# EAGLE design BoostConverter (EAGLE 9.3.1)
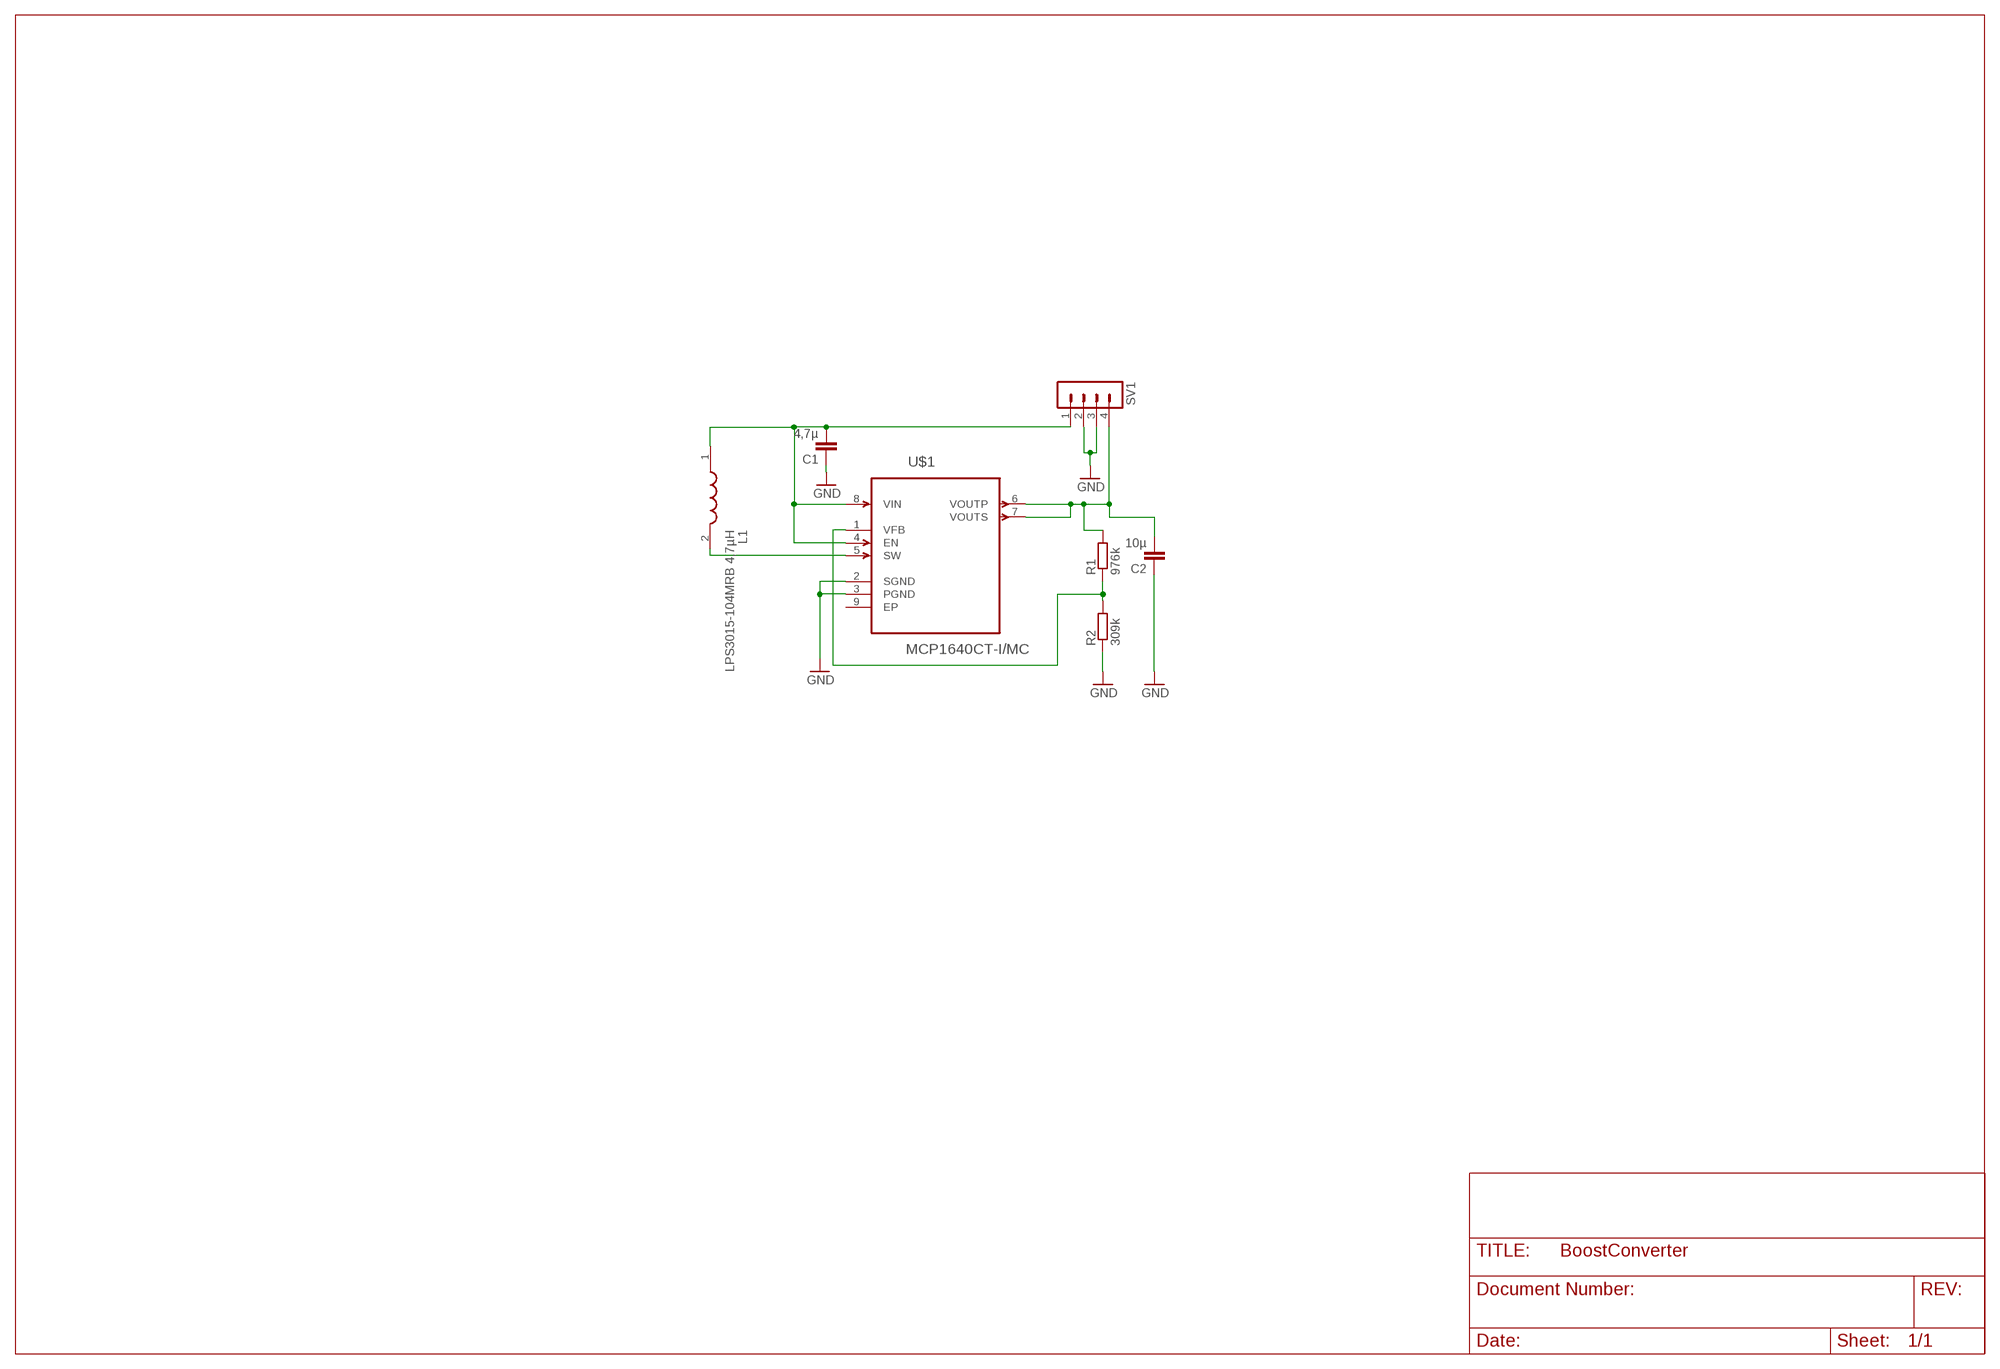
[diagram p0: schematic, sheet 1]

## Parts
C1  4,7µ  C-EUC0603  [C0603]
C2  10µ  C-EUC0603  [C0603]
L1  LPS3015-104MRB 4,7µH  LPS3015-104MRB  [LPS3015]
R1  976k  R-EU_R0603  [R0603]
R2  309k  R-EU_R0603  [R0603]
SV1  MA04-1  [MA04-1]
U$1  MCP1640CT-I/MC  [DFN200X300X100-9N]

## Nets
GND: C1.1 C2.1 R2.1 SV1.2 SV1.3 U$1.2(SGND) U$1.3(PGND)
N$1: C1.2 L1.1 SV1.1 U$1.4(EN) U$1.8(VIN)
N$4: L1.2 U$1.5(SW)
N$5: C2.2 R1.2 SV1.4 U$1.6(VOUTP) U$1.7(VOUTS)
N$6: R1.1 R2.2 U$1.1(VFB)
Unconnected: U$1.9(EP)

## Library data of the parts
C1 C2 = rcl:C-EU: CAPACITOR, European symbol; SPICEPREFIX: C
L1 = LPS3015-104MRB:LPS3015-104MRB: COILCRAFT - LPS3015-104MRB - INDUCTOR, SHLD, 100UH, 20%, 0.19A, SMD Source: Datasheet <http://www.coilcraft.com/pdfs/lps3015.pdf>; AVAILABILITY: Unavailable; DESCRIPTION: Power inductor, shielded, 20% tol, SMT, RoHS, lead-free, halogen-free; MF: Coilcraft; MP: LPS3015-104MRB; PACKAGE: None; PRICE: None
R1 R2 = rcl:R-EU_: RESISTOR, European symbol; SPICEPREFIX: R
SV1 = con-lstb:MA04-1: PIN HEADER; OC_FARNELL: unknown; OC_NEWARK: unknown
U$1 = MCP1640CT-I_MC:MCP1640CT-I/MC: Synchronous Boost Regulator; AVAILABILITY: Unavailable; DESCRIPTION: Boost Switching Regulator IC Positive Adjustable 2V 1 Output 350mA 8-VFDFN Exposed Pad; MF: Microchip; MP: MCP1640CT-I/MC; PACKAGE: DFN-8 Microchip; PRICE: None

## Board
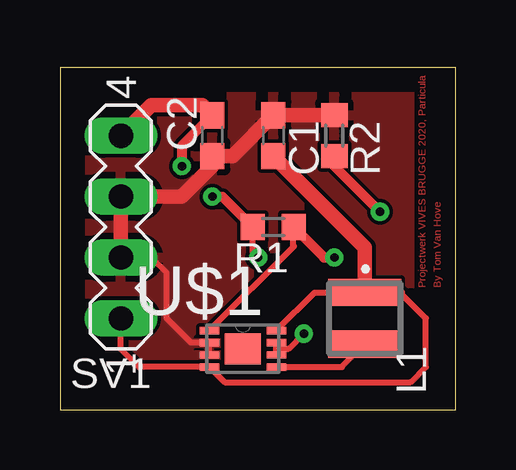
[diagram p1: board, top side]
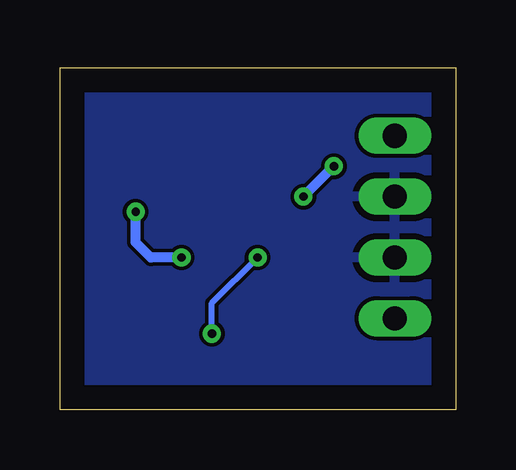
[diagram p2: board, bottom side, seen from below]

Size 16.49 x 14.28 mm. Coordinates in mm from the lower left corner, seen from the top.
Outline: 0,0 16.49,0 16.49,14.28 0,14.28 0,0
Copper layers (1*16): Top 0.035mm / dielectric 1.5mm / Bottom 0.035mm
Design rules "default": minimum track width 6mil, minimum drill 0.35mm, track to track 6mil, track to pad 6mil, pad to pad 6mil, via to via 6mil, smd to smd 6mil, copper to edge 40mil, drill to drill 6mil, minimum pad ring 10mil, minimum via ring 8mil, stop-mask expansion 4mil, vias tented up to drill 0mil, thermal gap 10mil

### Footprints (pad centres in the part's own frame; a part is rotated, then mirrored left to right if it is on the bottom)
C0603 = smd 1.1 x 1: 1 -0.85,0; 2 0.85,0
LPS3015 = smd 1.14 x 3.05: 1 -1.08,0; 2 1.08,0
R0603 = smd 1 x 1.1: 1 -0.85,0; 2 0.85,0
MA04-1 = drill 1.016 long: 1 -3.81,0; 2 -1.27,0; 3 1.27,0; 4 3.81,0
DFN200X300X100-9N = smd 0.813 x 0.305: 1 -1.397,0.762; 2 -1.397,0.254; 3 -1.397,-0.254; 4 -1.397,-0.762; 5 1.397,-0.762; 6 1.397,-0.254; 7 1.397,0.254; 8 1.397,0.762 | smd 1.499 x 1.295: 9 0,0

### Placement (x,y rotation side)
C1  8.89,11.43 270 top
C2  6.35,11.43 90 top
L1  12.7,3.81 270 top
R1  8.89,7.62 180 top
R2  11.43,11.43 270 top
SV1  2.54,7.62 90 top
U$1  7.62,2.54 0 top

### Tracks (layer width: path | path; a pad name or v marks a point on that pad's centre or on a via)
GND
  Top 0.254: U$1.3 U$1.2 5.46,2.79 4.45,3.81 4.45,5.71 3.81,6.35 SV1.2
  Top 0.61: R2.1 C1.1 7.19,10.58 C2.1 6.35,10.16 5.08,8.89 SV1.3 SV1.2
  pour Top: 0,0 0,13.97 16.51,13.97 16.51,0
  pour Bottom: 0,0 0,13.97 16.51,13.97 16.51,0
N$1
  Top 0.254: SV1.1 2.54,2.54 3.3,1.78 U$1.4 6.86,1.14 14.61,1.14 15.24,1.78 15.24,3.81 14.16,4.89 | L1.1 10.61,4.89 U$1.8
  Top 0.406: 14.16,4.89 L1.1
  Top 0.61: C1.2 12.7,6.77 L1.1
N$4
  Top 0.254: U$1.5 11.75,1.78 L1.2
N$5  (via drill 0.35)
  Top 0.254: U$1.6 9.02,2.54 | 9.02,2.54 U$1.7 | 9.02,2.54 9.53,2.54 v10.16,3.17 | v8.26,6.35 8.04,6.57 R1.2
  Top 0.406: C2.2 5.08,11.01 v5.08,10.16 | v6.35,8.89 6.77,8.89 R1.2
  Top 0.61: SV1.4 3.81,12.7 5.93,12.7 C2.2
  Bottom 0.254: v10.16,3.17 10.16,4.45 v8.26,6.35
  Bottom 0.406: v5.08,10.16 v6.35,8.89
N$6  (via drill 0.35)
  Top 0.254: U$1.1 9.72,6.79 | 9.72,6.79 9.74,6.82 | 9.72,6.79 9.72,7.6 R1.1
  Top 0.406: R1.1 11.01,6.35 v11.43,6.35 | v13.34,8.26 11.43,10.16 R2.2
  Bottom 0.406: v11.43,6.35 12.7,6.35 13.34,6.99 v13.34,8.26

### Text on the board
Top: Projectwerk VIVES BRUGGE 2020, Particula | By Tom Van Hove